# EAGLE design PIC18F4431 Dev_Board (EAGLE 9.4.2)
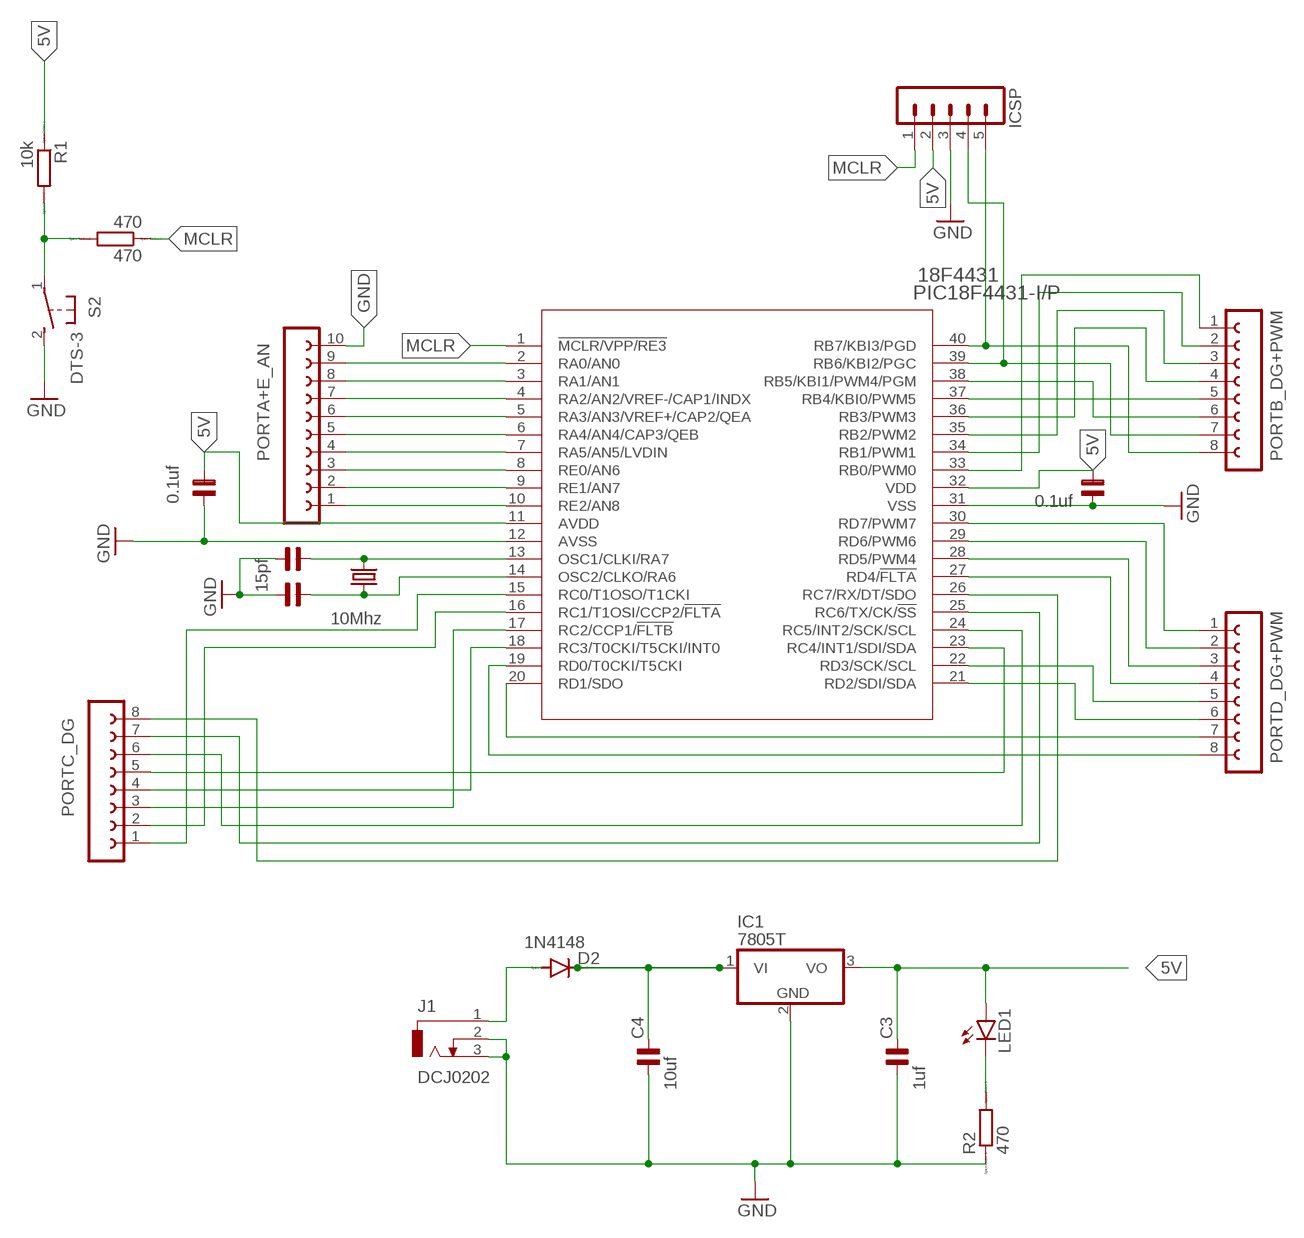
[diagram p0: schematic, sheet 1]

## Parts
18F4431  PIC18F4431-I/P  [PDIP40_600MC]
470  470  R0207/10  [0207/10]
C1  15pf  C-BP-1,5X4  [ENP1,5-4]
C2  15pf  C-BP-1,5X4  [ENP1,5-4]
C3  1uf  C-BP-1,5X4  [ENP1,5-4]
C4  10uf  C-BP-1,5X4  [ENP1,5-4]
C5  0.1uf  C-BP-1,5X4  [ENP1,5-4]
C6  0.1uf  C-BP-1,5X4  [ENP1,5-4]
D2  1N4148  1N4148DO35-7  [DO35-7]
IC1  7805T  [TO220H]
ICSP  MA05-1  [MA05-1]
J1  DCJ0202  [DCJ0202]
LED1  LED5MM  [LED5MM]
PORTA+E_AN  FE10-1  [FE10]
PORTB_DG+PWM  FE08-1  [FE08]
PORTC_DG  FE08-1  [FE08]
PORTD_DG+PWM  FE08-1  [FE08]
Q2  10Mhz  CRYSTALHC49S  [HC49/S]
R1  10k  R0207/10  [0207/10]
R2  470  R0207/10  [0207/10]
S2  DTS-3  [DTS-3]

## Nets
5V: 18F4431.11(AVDD) 18F4431.32(VDD) C3.2 C5.2 C6.2 IC1.3(VO) ICSP.2 LED1.A R1.1
GND: 18F4431.12(AVSS) 18F4431.31(VSS) C1.1 C2.1 C3.1 C4.1 C5.1 C6.1 IC1.2(GND) ICSP.3 J1.2 J1.3 PORTA+E_AN.10 R2.1 S2.2
MCLR: 18F4431.1(!MCLR/VPP/RE3) 470.1 ICSP.1
N$1: 18F4431.14(OSC2/CLKO/RA6) C2.2 Q2.1
N$2: 18F4431.13(OSC1/CLKI/RA7) C1.2 Q2.2
N$5: D2.A J1.1
N$8: LED1.K(C) R2.2
N$9: 18F4431.15(RC0/T1OSO/T1CKI) PORTC_DG.1
N$10: 18F4431.40(RB7/KBI3/PGD) ICSP.5 PORTB_DG+PWM.8
N$11: 18F4431.39(RB6/KBI2/PGC) ICSP.4 PORTB_DG+PWM.7
N$13: C4.2 D2.C IC1.1(VI)
N$14: 470.2 R1.2 S2.1
N$15: 18F4431.38(RB5/KBI1/PWM4/PGM) PORTB_DG+PWM.6
N$16: 18F4431.37(RB4/KBI0/PWM5) PORTB_DG+PWM.5
N$17: 18F4431.36(RB3/PWM3) PORTB_DG+PWM.4
N$18: 18F4431.35(RB2/PWM2) PORTB_DG+PWM.3
N$19: 18F4431.34(RB1/PWM1) PORTB_DG+PWM.2
N$20: 18F4431.33(RB0/PWM0) PORTB_DG+PWM.1
N$21: 18F4431.30(RD7/PWM7) PORTD_DG+PWM.1
N$22: 18F4431.29(RD6/PWM6) PORTD_DG+PWM.2
N$23: 18F4431.28(RD5/PWM4) PORTD_DG+PWM.3
N$24: 18F4431.27(RD4/!FLTA) PORTD_DG+PWM.4
N$25: 18F4431.22(RD3/SCK/SCL) PORTD_DG+PWM.5
N$26: 18F4431.21(RD2/SDI/SDA) PORTD_DG+PWM.6
N$27: 18F4431.20(RD1/SDO) PORTD_DG+PWM.7
N$28: 18F4431.19(RD0/T0CKI/T5CKI) PORTD_DG+PWM.8
N$29: 18F4431.2(RA0/AN0) PORTA+E_AN.9
N$30: 18F4431.3(RA1/AN1) PORTA+E_AN.8
N$31: 18F4431.4(RA2/AN2/VREF-/CAP1/INDX) PORTA+E_AN.7
N$32: 18F4431.5(RA3/AN3/VREF+/CAP2/QEA) PORTA+E_AN.6
N$33: 18F4431.6(RA4/AN4/CAP3/QEB) PORTA+E_AN.5
N$34: 18F4431.7(RA5/AN5/LVDIN) PORTA+E_AN.4
N$35: 18F4431.8(RE0/AN6) PORTA+E_AN.3
N$36: 18F4431.9(RE1/AN7) PORTA+E_AN.2
N$37: 18F4431.10(RE2/AN8) PORTA+E_AN.1
N$38: 18F4431.16(RC1/T1OSI/CCP2/!FLTA) PORTC_DG.2
N$39: 18F4431.17(RC2/CCP1/!FLTB) PORTC_DG.3
N$40: 18F4431.18(RC3/T0CKI/T5CKI/INT0) PORTC_DG.4
N$41: 18F4431.23(RC4/INT1/SDI/SDA) PORTC_DG.5
N$42: 18F4431.24(RC5/INT2/SCK/SCL) PORTC_DG.6
N$43: 18F4431.25(RC6/TX/CK/!SS) PORTC_DG.7
N$44: 18F4431.26(RC7/RX/DT/SDO) PORTC_DG.8

## Library data of the parts
18F4431 = PIC18F4431:PIC18F4431-I/P: PIC18F4431; MANUFACTURER_PART_NUMBER: PIC18F4431IP; VENDOR: Microchip
470 R1 R2 = eagle-ltspice:R: RESISTOR, European symbol; SPICEMODEL: NONE; SPICEPREFIX: R
C1-C6 = cap-pan40:C-BP: BIPOLAR ELECTROLYTIC
D2 = diode:1N4148: DIODE high speed (Philips)
IC1 = linear:78*: Positive VOLTAGE REGULATOR Source: http://cache.national.com/ds/LM/LM78L05.pdf http://www.fairchildsemi.com/ds/LM/LM7805.pdf
ICSP = con-lstb:MA05-1: PIN HEADER; OC_FARNELL: unknown; OC_NEWARK: unknown
J1 = con-jack:DCJ0202: DC POWER JACK Source: DCJ0202.pdf; OC_FARNELL: unknown; OC_NEWARK: unknown
LED1 = led:LED: LED OSRAM: - CHIPLED LG R971, LG N971, LY N971, LG Q971, LY Q971, LO R971, LY R971 LH N974, LH R974 LS Q976, LO Q976, LY Q976 LO Q996 - Hyper CHIPLED LW Q18S LB Q993, LB Q99A, LB R99A - SideLED LS A670, LO A670, LY A670, LG A670, LP A670 LB A673, LV A673, LT A673, LW A673 LH A674 LY A675 LS A676, LA A676, LO A676, LY A676, LW A676 LS A679, LY A679, LG A679 - Hyper Micro SIDELED® LS Y876, LA Y876, LO Y876, LY Y876 LT Y87S - SmartLED LW L88C, LW L88S LB L89C, LB L89S, LG L890 LS L89K, LO L89K, LY L89K LS L896, LA L896, LO L896, LY L896 - TOPLED LS T670, LO T670, LY T670, LG T670, LP T670 LSG T670, LSP T670, LSY T670, LOP T670, LYG T670 LG T671, LOG T671, LSG T671 LB T673, LV T673, LT T673, LW T673 LH T674 LS T676, LA T676, LO T676, LY T676, LB T676, LH T676, LSB T676, LW T676 LB T67C, LV T67C, LT T67C, LS T67K, LO T67K, LY T67K, LW E67C LS E67B, LA E67B, LO E67B, LY E67B, LB E67C, LV E67C, LT E67C LW T67C LS T679, LY T679, LG T679 LS T770, LO T770, LY T770, LG T770, LP T770 LB T773, LV T773, LT T773, LW T773 LH T774 LS E675, LA E675, LY E675, LS T675 LS T776, LA T776, LO T776, LY T776, LB T776 LHGB T686 LT T68C, LB T68C - Hyper Mini TOPLED® LB M676 - Mini TOPLED Santana® LG M470 LS M47K, LO M47K, LY M47K Source: http://www.osram.convergy.de LUXEON: - LUMILED® LXK2-PW12-R00, LXK2-PW12-S00, LXK2-PW14-U00, LXK2-PW14-V00 LXK2-PM12-R00, LXK2-PM12-S00, LXK2-PM14-U00 LXK2-PE12-Q00, LXK2-PE12-R00, LXK2-PE12-S00, LXK2-PE14-T00, LXK2-PE14-U00 LXK2-PB12-K00, LXK2-PB12-L00, LXK2-PB12-M00, LXK2-PB14-N00, LXK2-PB14-P00, LXK2-PB14-Q00 LXK2-PR12-L00, LXK2-PR12-M00, LXK2-PR14-Q00, LXK2-PR14-R00 LXK2-PD12-Q00, LXK2-PD12-R00, LXK2-PD12-S00 LXK2-PH12-R00, LXK2-PH12-S00 LXK2-PL12-P00, LXK2-PL12-Q00, LXK2-PL12-R00 Source: www.luxeon.com KINGBRIGHT: KA-3528ASYC Source: www.kingbright.com
PORTA+E_AN = con-lsta:FE10-1: FEMALE HEADER; OC_FARNELL: unknown; OC_NEWARK: unknown
PORTB_DG+PWM PORTC_DG PORTD_DG+PWM = con-lsta:FE08-1: FEMALE HEADER; OC_FARNELL: unknown; OC_NEWARK: unknown
Q2 = crystal:CRYSTAL: CRYSTAL; OC_FARNELL: 1667008; OC_NEWARK: unknown
S2 = switch-tact:DTS-3

## Board
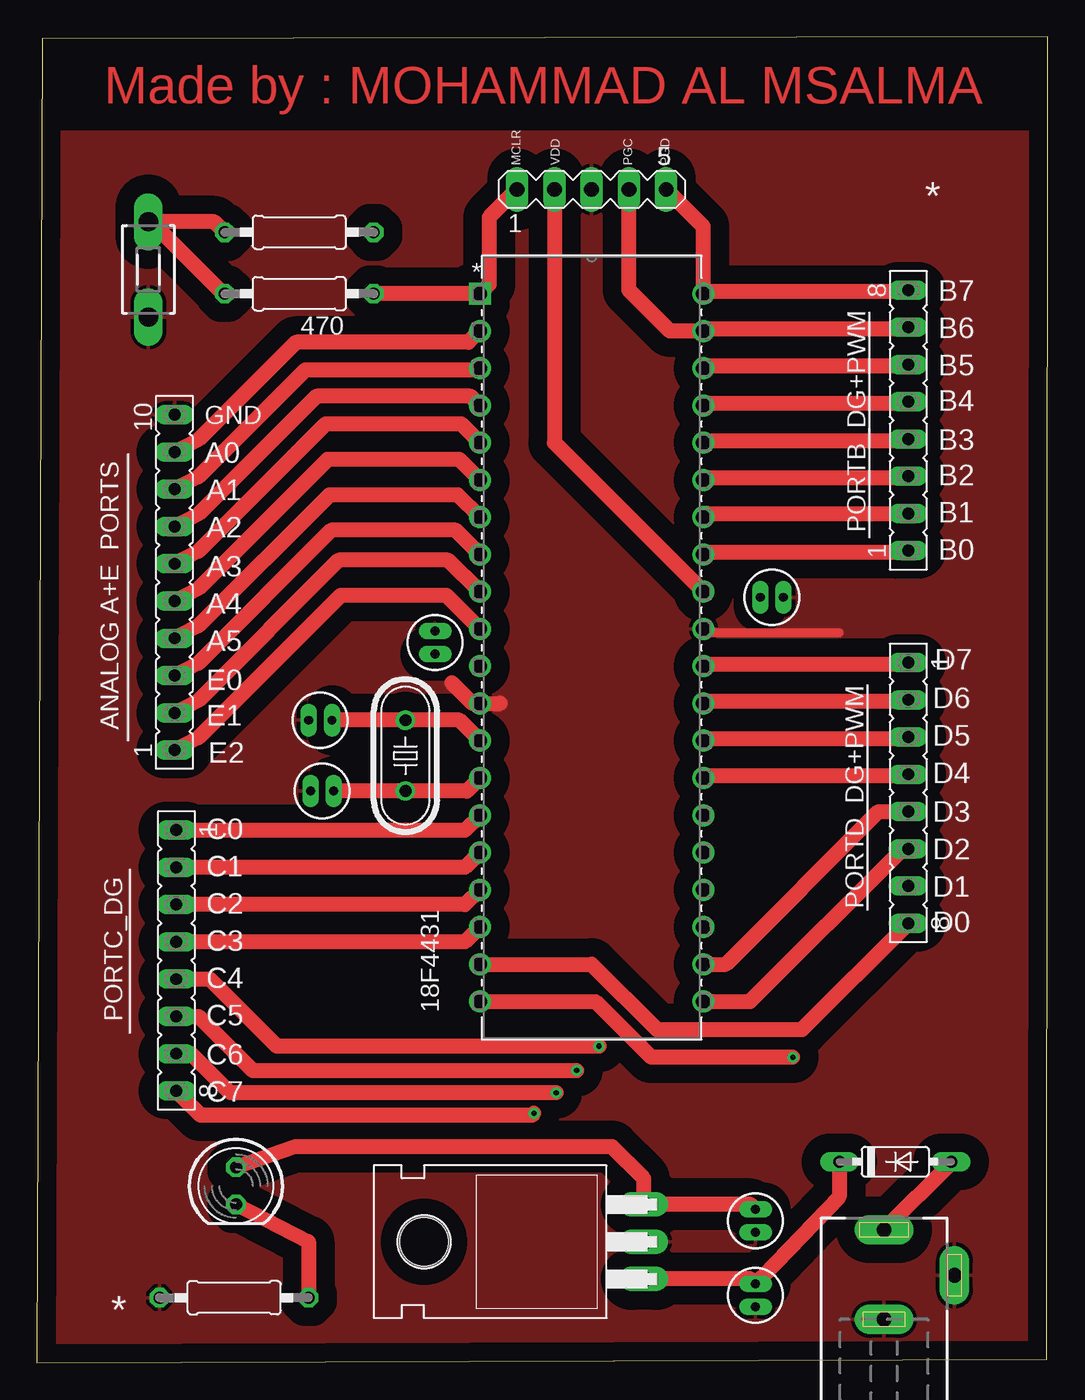
[diagram p1: board, top side]
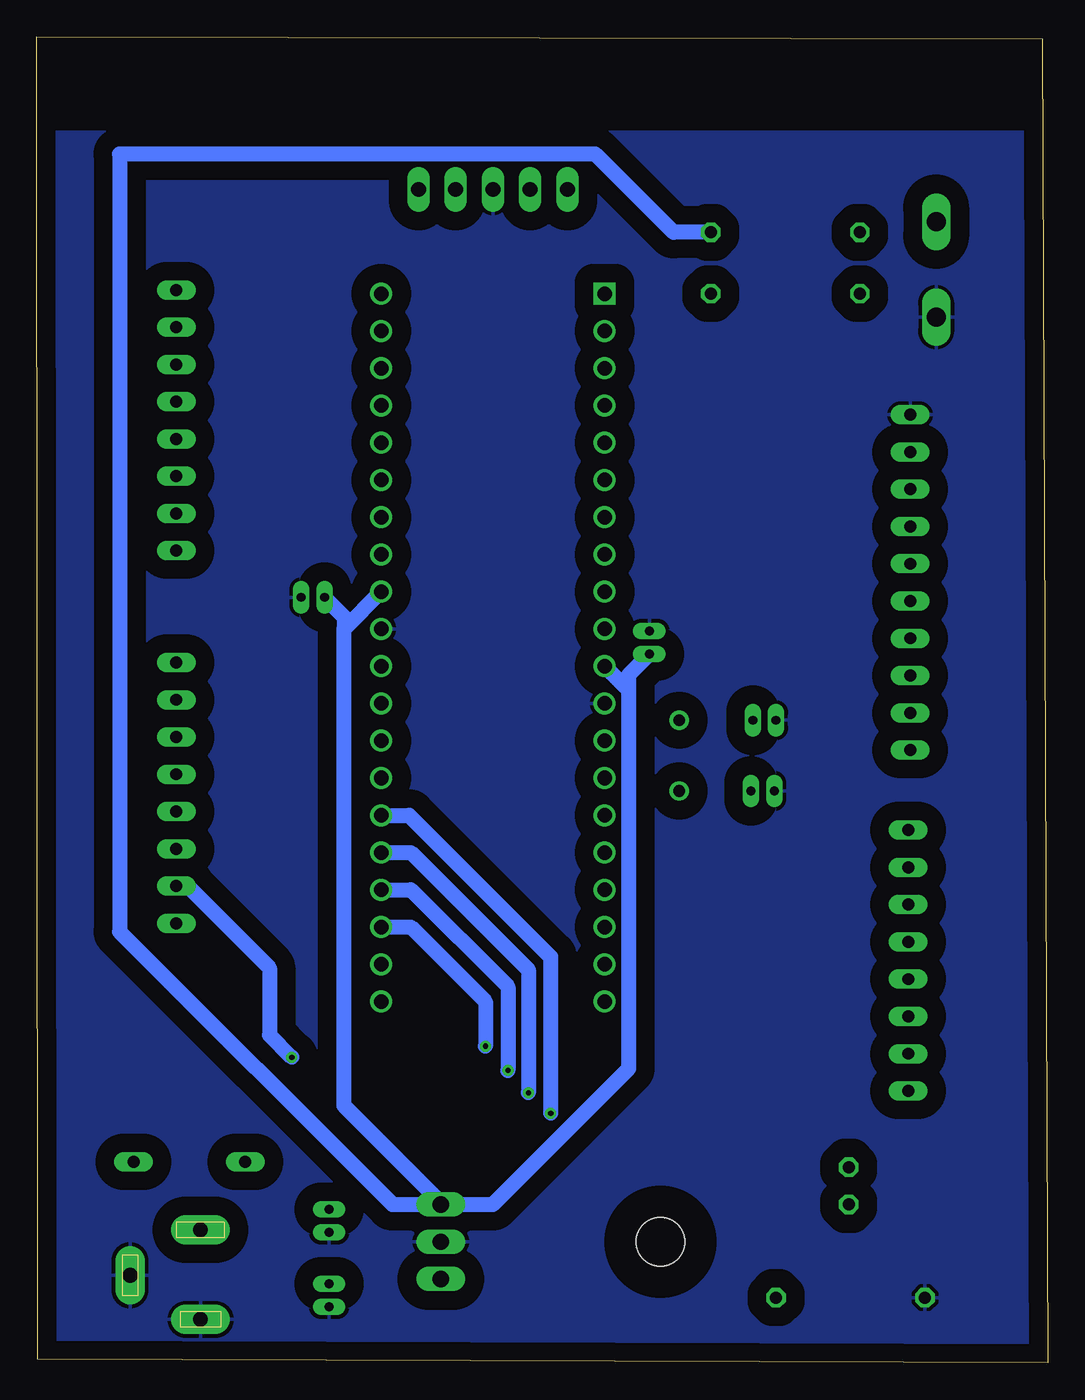
[diagram p2: board, bottom side, seen from below]

Size 68.96 x 90.42 mm. Coordinates in mm from the lower left corner, seen from the top.
Outline: 0,0 68.89,0.25 68.96,90.42 0.38,90.29 0,0
Copper layers (1*16): Top 0.035mm / dielectric 1.5mm / Bottom 0.035mm
Design rules "default": minimum track width 6mil, minimum drill 0.35mm, track to track 6mil, track to pad 6mil, pad to pad 6mil, via to via 6mil, smd to smd 6mil, copper to edge 40mil, drill to drill 6mil, minimum pad ring 10mil, minimum via ring 8mil, stop-mask expansion 4mil, vias tented up to drill 0mil, thermal gap 10mil

### Footprints (pad centres in the part's own frame; a part is rotated, then mirrored left to right if it is on the bottom)
PDIP40_600MC = drill 0.991 pad 1.499 square: 1 -15.24,48.26 | drill 0.991 pad 1.499: 2 -15.24,45.72; 3 -15.24,43.18; 4 -15.24,40.64; 5 -15.24,38.1; 6 -15.24,35.56; 7 -15.24,33.02; 8 -15.24,30.48; 9 -15.24,27.94; 10 -15.24,25.4; 11 -15.24,22.86; 12 -15.24,20.32; 13 -15.24,17.78; 14 -15.24,15.24; 15 -15.24,12.7; 16 -15.24,10.16; 17 -15.24,7.62; 18 -15.24,5.08; 19 -15.24,2.54; 20 -15.24,0; 21 0,0; 22 0,2.54; 23 0,5.08; 24 0,7.62; 25 0,10.16; 26 0,12.7; 27 0,15.24; 28 0,17.78; 29 0,20.32; 30 0,22.86; 31 0,25.4; 32 0,27.94; 33 0,30.48; 34 0,33.02; 35 0,35.56; 36 0,38.1; 37 0,40.64; 38 0,43.18; 39 0,45.72; 40 0,48.26
0207/10 = drill 0.813 octagon: 1 -5.08,0; 2 5.08,0
ENP1,5-4 = drill 0.61 pad 0.813 long: 1 -0.635,0; 2 0.953,0
DO35-7 = drill 0.813 long: A 3.81,0; C -3.81,0
TO220H = drill 1.118 long: 1 -2.54,-10.16; 2 0,-10.16; 3 2.54,-10.16 | hole 3.302: 0,4.826
MA05-1 = drill 1.016 long: 1 -5.08,0; 2 -2.54,0; 3 0,0; 4 2.54,0; 5 5.08,0
DCJ0202 = drill 1 pad 2 long: 1 0,3.1; 2 4.8,0; 3 0,-3
LED5MM = drill 0.813 octagon: A -1.27,0; K 1.27,0
FE10 = drill 0.813 long: 1 -11.43,0; 2 -8.89,0; 3 -6.35,0; 4 -3.81,0; 5 -1.27,0; 6 1.27,0; 7 3.81,0; 8 6.35,0; 9 8.89,0; 10 11.43,0
FE08 = drill 0.813 long: 1 -8.89,0; 2 -6.35,0; 3 -3.81,0; 4 -1.27,0; 5 1.27,0; 6 3.81,0; 7 6.35,0; 8 8.89,0
HC49/S = drill 0.813: 1 -2.413,0; 2 2.413,0
DTS-3 = drill 1.3 long: 1 -3.25,0; 2 3.25,0

### Placement (x,y rotation side)
18F4431  45.47,24.64 0 top
470  17.91,72.9 180 top
C1  19.18,43.81 0 top
C2  19.3,38.99 0 top
C3  49.02,9.53 90 top
C4  49.02,4.45 90 top
C5  50.29,52.2 180 top
C6  27.18,49.28 270 top
D2  58.55,13.72 0 top
IC1  31.24,8.26 90 top
ICSP  37.85,80.01 0 top
J1  57.78,5.97 0 top
LED1  13.59,12.06 270 top
PORTA+E_AN  9.4,53.21 90 top
PORTB_DG+PWM  59.44,64.26 90 top
PORTC_DG  9.53,27.43 270 top
PORTD_DG+PWM  59.44,38.86 270 top
Q2  25.15,41.4 90 top
R1  17.91,77.09 180 top
R2  13.46,4.45 0 top
S2  7.62,74.55 270 top

### Tracks (layer width: path | path; a pad name or v marks a point on that pad's centre or on a via)
5V
  Top 1.016: C3.2 48.7,10.79 IC1.3 41.4,12.57 39.24,14.73 17.64,14.73 LED1.A | ICSP.2 35.31,62.74 18F4431.32
  Bottom 0.152: 41.4,10.92 IC1.3
  Bottom 1.016: 48.01,50.04 48.01,17.53 41.4,10.92 | 28.57,45.85 18F4431.11 | 18F4431.32 48.01,50.04 | C5.2 48.01,50.86 48.01,50.04 | C6.2 28.57,46.93 28.57,45.85 | 28.57,45.85 28.57,20.07 37.85,10.79 IC1.3 44.7,10.79 63.3,29.39 63.3,82.42 30.86,82.42 25.53,77.09 R1.1
GND
  Top 0.61: 18F4431.31 45.72,49.78 54.74,49.78
  Top 1.016: 28.32,46.35 29.72,44.96 18F4431.12 31.62,44.96
  pour Top (isolate 1.27): 0.76,83.95 0.76,0.76 68.58,0.76 68.58,83.95
  pour Bottom (isolate 1.27): 68.58,83.95 68.58,0.76 0.76,0.76 0.76,83.95
MCLR
  Top 1.016: ICSP.1 30.86,78.11 30.86,73.53 18F4431.1 470.1
N$1
  Top 1.016: 18F4431.14 29.34,38.99 Q2.1 C2.2
N$2
  Top 1.016: 18F4431.13 28.83,43.81 Q2.2 C1.2
N$5
  Top 0.152: D2.A 62.36,13.64
  Top 1.016: 62.36,13.64 J1.1
N$8
  Top 1.016: LED1.K 18.54,8.26 R2.2
N$9
  Top 1.016: 18F4431.15 29.21,36.32 PORTC_DG.1
N$10
  Top 0.152: PORTB_DG+PWM.8 59.31,73.03 | 45.59,73.03 18F4431.40
  Top 1.016: 59.31,73.03 45.59,73.03 | 18F4431.40 45.47,77.47 ICSP.5
N$11
  Top 0.152: PORTB_DG+PWM.7 59.31,70.48 | 45.59,70.48 18F4431.39
  Top 1.016: 59.31,70.48 45.59,70.48 | 18F4431.39 43.18,70.36 40.39,73.15 ICSP.4
N$13
  Top 1.016: IC1.1 48.7,5.71 C4.2 49.53,5.91 54.74,11.33 D2.C
N$14
  Top 1.016: 470.2 12.7,72.9 7.72,77.87 S2.1 12.12,77.8 R1.2
N$15
  Top 0.152: PORTB_DG+PWM.6 59.31,67.94 | 45.59,67.94 18F4431.38
  Top 1.016: 59.31,67.94 45.59,67.94
N$16
  Top 0.152: PORTB_DG+PWM.5 59.31,65.41 | 45.59,65.41 18F4431.37
  Top 1.016: 59.31,65.41 45.59,65.41
N$17
  Top 0.152: PORTB_DG+PWM.4 59.31,62.87 | 45.59,62.87 18F4431.36
  Top 1.016: 59.31,62.87 45.59,62.87
N$18
  Top 0.152: PORTB_DG+PWM.3 59.31,60.33 | 45.59,60.33 18F4431.35
  Top 1.016: 59.31,60.33 45.59,60.33
N$19
  Top 0.152: 18F4431.34 45.72,57.91
  Top 1.016: 45.72,57.91 PORTB_DG+PWM.2
N$20
  Top 0.152: PORTB_DG+PWM.1 59.31,55.24 | 45.59,55.24 18F4431.33
  Top 1.016: 59.31,55.24 45.59,55.24
N$21
  Top 0.152: PORTD_DG+PWM.1 59.31,47.62 | 45.59,47.62 18F4431.30
  Top 1.016: 59.31,47.62 45.59,47.62
N$22
  Top 0.152: PORTD_DG+PWM.2 59.31,45.09 | 45.59,45.09 18F4431.29
  Top 1.016: 59.31,45.09 45.59,45.09
N$23
  Top 0.152: PORTD_DG+PWM.3 59.31,42.55 | 45.59,42.55 18F4431.28
  Top 1.016: 59.31,42.55 45.59,42.55
N$24
  Top 0.152: 18F4431.27 45.59,40.01 | 59.31,40.01 PORTD_DG+PWM.4
  Top 1.016: 59.31,40.01 45.59,40.01
N$25
  Top 1.016: PORTD_DG+PWM.5 57.4,37.59 46.99,27.18 18F4431.22
N$26
  Top 1.016: 18F4431.21 48.64,24.64 59.05,35.05 PORTD_DG+PWM.6
N$27  (via drill 0.35)
  Top 1.016: 18F4431.20 38.1,24.64 41.91,20.83 v51.56,20.83
  Bottom 1.016: PORTD_DG+PWM.7 58.67,32.51 53.09,26.92 53.09,22.35 v51.56,20.83
N$28
  Top 1.016: 18F4431.19 37.85,27.18 42.29,22.73 52.2,22.73 PORTD_DG+PWM.8
N$29
  Top 1.016: PORTA+E_AN.9 11.04,62.96 17.68,69.6 29.46,69.6 18F4431.2
N$30
  Top 1.016: PORTA+E_AN.8 11.04,60.42 18.31,67.69 30.1,67.69 18F4431.3
N$31
  Top 1.016: PORTA+E_AN.7 11.04,57.88 19.07,65.91 29.59,65.91 18F4431.4
N$32
  Top 1.016: PORTA+E_AN.6 11.04,55.34 19.71,64.01 28.96,64.01 18F4431.5
N$33
  Top 1.016: PORTA+E_AN.5 11.04,52.8 19.84,61.59 28.83,61.59 18F4431.6
N$34
  Top 1.016: PORTA+E_AN.4 11.04,50.26 19.96,59.18 28.7,59.18 18F4431.7
N$35
  Top 1.016: PORTA+E_AN.3 11.04,47.72 20.09,56.77 28.57,56.77 18F4431.8
N$36
  Top 1.016: PORTA+E_AN.2 11.04,45.18 20.6,54.74 28.07,54.74 18F4431.9
N$37
  Top 1.016: PORTA+E_AN.1 11.04,42.64 20.73,52.32 27.94,52.32 18F4431.10
N$38
  Top 1.016: 18F4431.16 29.21,33.78 PORTC_DG.2
N$39
  Top 1.016: 18F4431.17 29.21,31.24 PORTC_DG.3
N$40
  Top 1.016: 18F4431.18 29.21,28.7 PORTC_DG.4
N$41  (via drill 0.35)
  Top 1.016: v38.35,21.59 16.38,21.59 11.81,26.16 PORTC_DG.5
  Bottom 1.016: 18F4431.23 43.43,29.72 38.35,24.64 v38.35,21.59
N$42  (via drill 0.35)
  Top 1.016: v36.83,19.94 14.73,19.94 11.05,23.62 PORTC_DG.6
  Bottom 1.016: 18F4431.24 43.43,32.26 36.83,25.65 v36.83,19.94
N$43  (via drill 0.35)
  Top 1.016: v35.43,18.41 13.21,18.41 10.54,21.08 PORTC_DG.7
  Bottom 1.016: 18F4431.25 43.43,34.8 35.43,26.8 v35.43,18.41
N$44  (via drill 0.35)
  Top 1.016: v33.91,17.02 33.78,16.89 11.18,16.89 PORTC_DG.8
  Bottom 1.016: 18F4431.26 43.56,37.34 33.91,27.69 v33.91,17.02

### Text on the board
Top: Made by : MOHAMMAD AL MSALMA
tNames: MCLR | VDD | PGC | PGD | * | B7 | B6 | B5 | B4 | GND | B3 | ANALOG A+E PORTS | A0 | B2 | A1 | B1 | A2 | ___________ | B0 | A3 | A4 | A5 | D7 | E0 | E1 | ______________ | E2 | D6 / D5 / D4 | C0 | C1 | D3 / D2 / D1 | C2 | ___________ | D0 | C3 | C4 | C5 | ________ | C6 | C7 | *